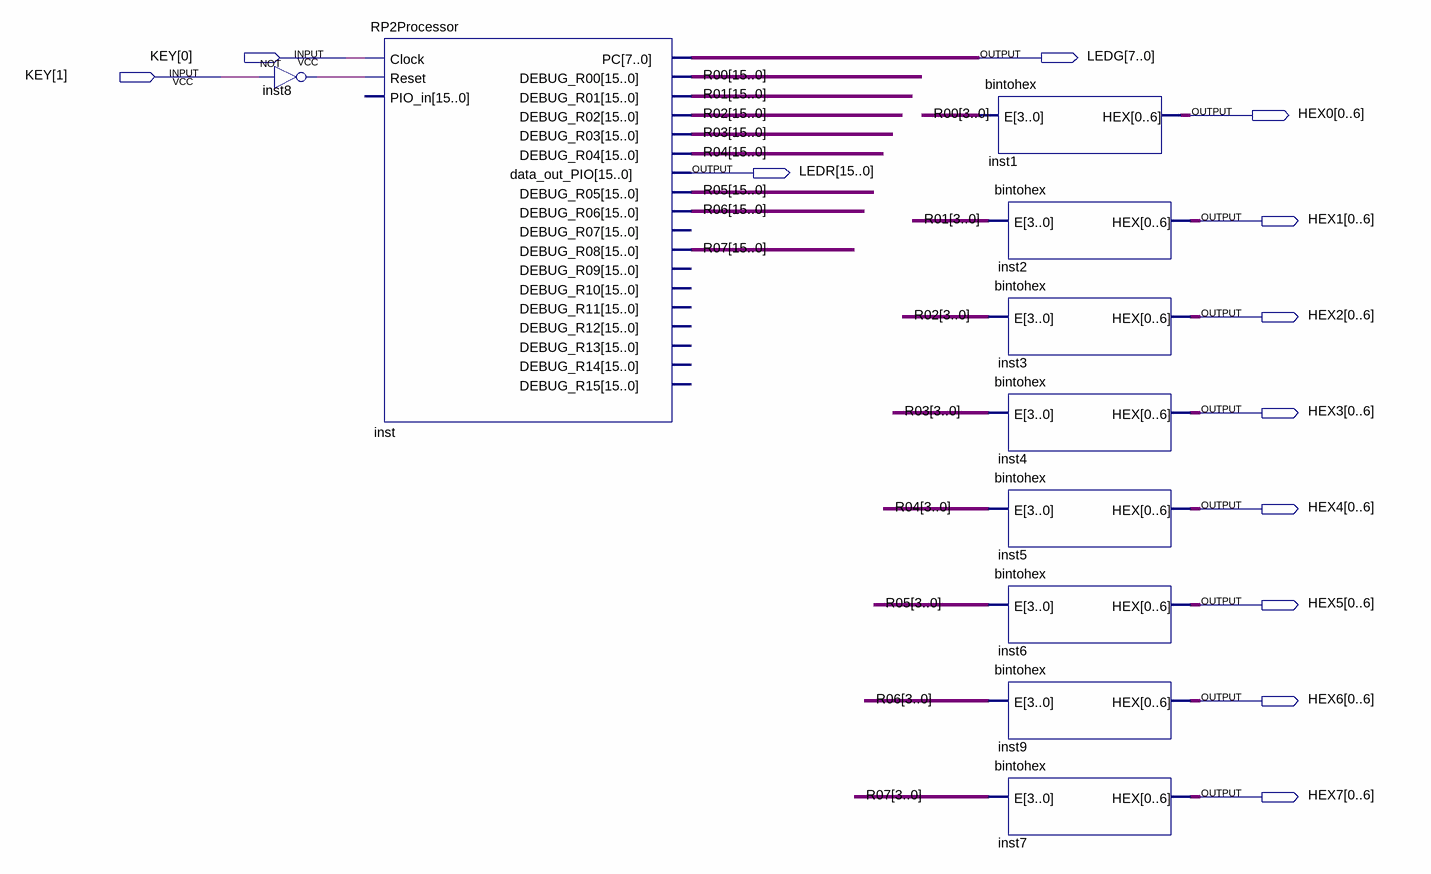
[diagram p0: schematic sheet]
// Quartus schematic TestRP2.bdf as structural Verilog: 10 symbols, 12 pins
module TestRP2 (
  input  [1:0] KEY,
  output [7:0] LEDG,
  output [0:6] HEX0,
  output [15:0] LEDR,
  output [0:6] HEX1,
  output [0:6] HEX2,
  output [0:6] HEX3,
  output [0:6] HEX4,
  output [0:6] HEX5,
  output [0:6] HEX6,
  output [0:6] HEX7
);

  wire inst8_out;
  wire [15:0] R00, R01, R02, R03, R04, R05, R06, R07;

  not inst8 (inst8_out, KEY[1]);
  RP2Processor inst (
    .Clock(KEY[0]), .Reset(inst8_out), .PC(LEDG), .DEBUG_R00(R00), .DEBUG_R01(R01), .DEBUG_R02(R02),
    .DEBUG_R03(R03), .DEBUG_R04(R04), .data_out_PIO(LEDR), .DEBUG_R05(R05), .DEBUG_R06(R06), .DEBUG_R08(R07));  // open: PIO_in, DEBUG_R07, DEBUG_R09, DEBUG_R10, DEBUG_R11, DEBUG_R12, DEBUG_R13, DEBUG_R14, DEBUG_R15
  bintohex inst1 (.E(R00[3:0]), .HEX(HEX0));
  bintohex inst2 (.E(R01[3:0]), .HEX(HEX1));
  bintohex inst3 (.E(R02[3:0]), .HEX(HEX2));
  bintohex inst4 (.E(R03[3:0]), .HEX(HEX3));
  bintohex inst5 (.E(R04[3:0]), .HEX(HEX4));
  bintohex inst6 (.E(R05[3:0]), .HEX(HEX5));
  bintohex inst9 (.E(R06[3:0]), .HEX(HEX6));
  bintohex inst7 (.E(R07[3:0]), .HEX(HEX7));
endmodule
